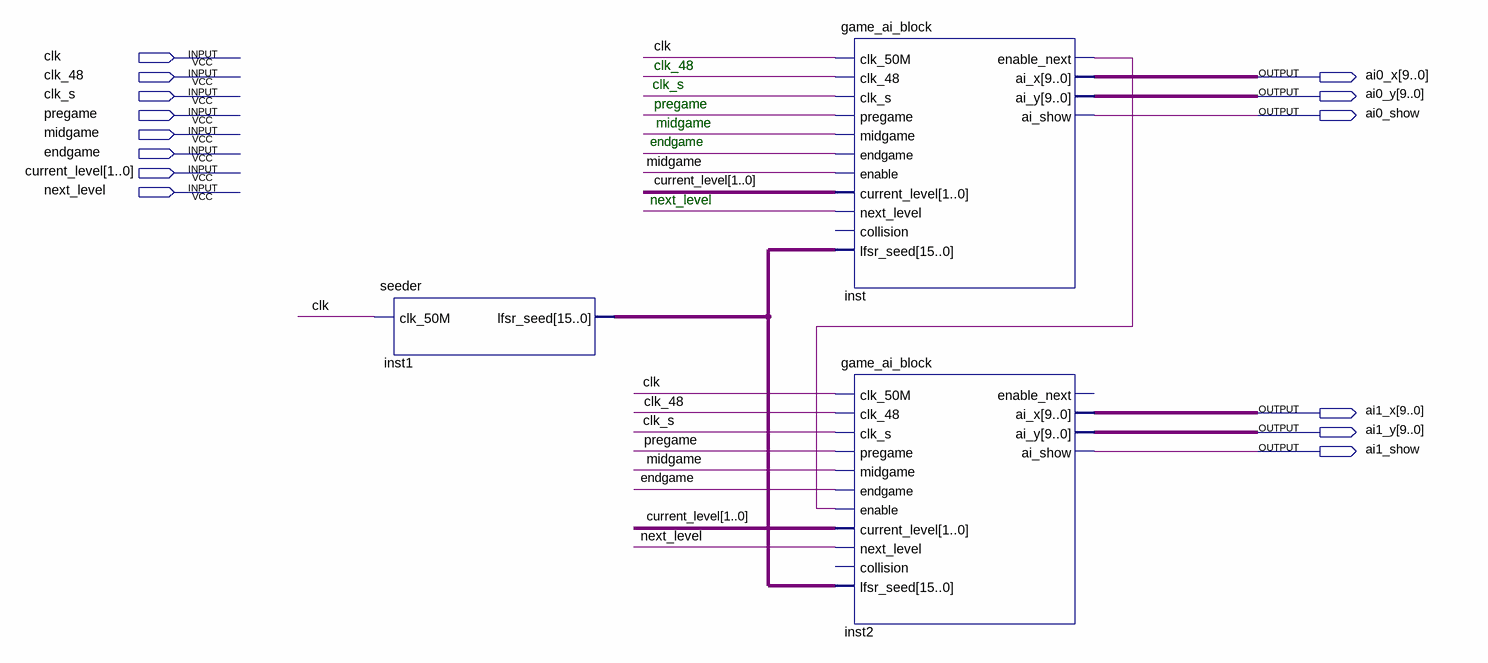
[diagram p0: schematic sheet]
// Quartus schematic test_game_ai_block.bdf as structural Verilog: 3 symbols, 14 pins
module test_game_ai_block (
  input  clk,
  input  clk_48,
  input  clk_s,
  input  pregame,
  input  midgame,
  input  endgame,
  input  [1:0] current_level,
  input  next_level,
  output [9:0] ai0_x,
  output [9:0] ai0_y,
  output ai0_show,
  output [9:0] ai1_x,
  output [9:0] ai1_y,
  output ai1_show
);

  wire inst_enable_next;
  wire [15:0] inst1_lfsr_seed;

  seeder inst1 (.clk_50M(clk), .lfsr_seed(inst1_lfsr_seed));
  game_ai_block inst (
    .clk_50M(clk), .clk_48(clk_48), .clk_s(clk_s), .pregame(pregame), .midgame(midgame), .endgame(endgame),
    .enable(midgame), .current_level(current_level), .next_level(next_level), .lfsr_seed(inst1_lfsr_seed),
    .enable_next(inst_enable_next), .ai_x(ai0_x), .ai_y(ai0_y), .ai_show(ai0_show));  // open: collision
  game_ai_block inst2 (
    .clk_50M(clk), .clk_48(clk_48), .clk_s(clk_s), .pregame(pregame), .midgame(midgame), .endgame(endgame),
    .enable(inst_enable_next), .current_level(current_level), .next_level(next_level),
    .lfsr_seed(inst1_lfsr_seed), .ai_x(ai1_x), .ai_y(ai1_y), .ai_show(ai1_show));  // open: collision, enable_next

  // Notes on the sheet:
  //   clk_48
  //   clk_s
  //   pregame
  //   midgame
  //   endgame
  //   next_level
endmodule
